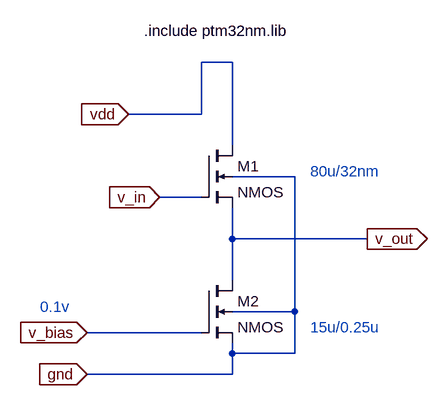
[diagram p0: schematic cd_buffer_const_pot.asc]
cd_buffer_const_pot.asc, the LTspice schematic file:
Version 4
SHEET 1 880 680
WIRE 224 -16 176 -16
WIRE 176 64 176 -16
WIRE 176 64 64 64
WIRE 224 112 224 -16
WIRE 320 160 224 160
WIRE 176 192 112 192
WIRE 224 256 224 208
WIRE 432 256 224 256
WIRE 224 320 224 256
WIRE 320 368 320 160
WIRE 320 368 224 368
WIRE 176 400 0 400
WIRE 224 432 224 416
WIRE 320 432 320 368
WIRE 320 432 224 432
WIRE 224 464 224 432
WIRE 224 464 0 464
FLAG 432 256 v_out
IOPIN 432 256 Out
FLAG 0 400 v_bias
IOPIN 0 400 In
FLAG 112 192 v_in
IOPIN 112 192 In
FLAG 64 64 vdd
IOPIN 64 64 In
FLAG 0 464 gnd
IOPIN 0 464 In
SYMBOL nmos4 176 112 R0
SYMATTR InstName M1
SYMATTR Value2 l=32nm w=80u
SYMBOL nmos4 176 320 R0
SYMATTR InstName M2
SYMATTR Value2 l=0.25u w=15u
TEXT 344 152 Left 2 ;80u/32nm
TEXT 344 392 Left 2 ;15u/0.25u
TEXT 88 -64 Left 2 !.include ptm32nm.lib
TEXT -72 360 Left 2 ;0.1v

The netlist it stands for:
* cd_buffer_const_pot.asc
M1 vdd v_in v_out gnd NMOS l=32nm w=80u
M2 v_out v_bias gnd gnd NMOS l=0.25u w=15u
.model NMOS NMOS
.model PMOS PMOS
.lib standard.mos
* 80u/32nm
* 15u/0.25u
.include ptm32nm.lib
* 0.1v
.backanno
.end